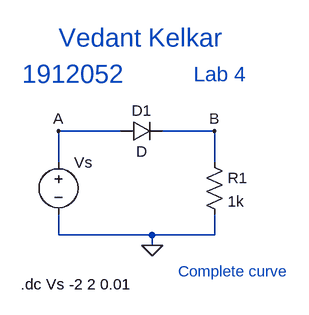
[diagram p0: schematic Draft11.asc]
Draft11.asc, the LTspice schematic file:
Version 4
SHEET 1 880 680
WIRE 160 96 64 96
WIRE 304 96 224 96
WIRE 64 144 64 96
WIRE 304 144 304 96
WIRE 64 256 64 224
WIRE 208 256 64 256
WIRE 304 256 304 224
WIRE 304 256 208 256
WIRE 208 272 208 256
FLAG 208 272 0
FLAG 64 96 A
FLAG 304 96 B
SYMBOL voltage 64 128 R0
WINDOW 123 0 0 Left 0
WINDOW 39 0 0 Left 0
SYMATTR InstName Vs
SYMATTR Value ""
SYMBOL res 288 128 R0
SYMATTR InstName R1
SYMATTR Value 1k
SYMBOL diode 160 112 R270
WINDOW 0 32 32 VTop 2
WINDOW 3 0 32 VBottom 2
SYMATTR InstName D1
TEXT 64 -48 Left 4 ;Vedant Kelkar
TEXT 8 8 Left 4 ;1912052
TEXT 272 8 Left 3 ;Lab 4
TEXT 248 312 Left 2 ;Complete curve
TEXT 6 332 Left 2 !.dc Vs -2 2 0.01

The netlist it stands for:
* Draft11.asc
Vs A 0
R1 B 0 1k
D1 A B D
.model D D
.lib standard.dio
* Vedant Kelkar
* 1912052
* Lab 4
* Complete curve
.dc Vs -2 2 0.01
.backanno
.end